# Altium project UV16 PDU.PrjPcb
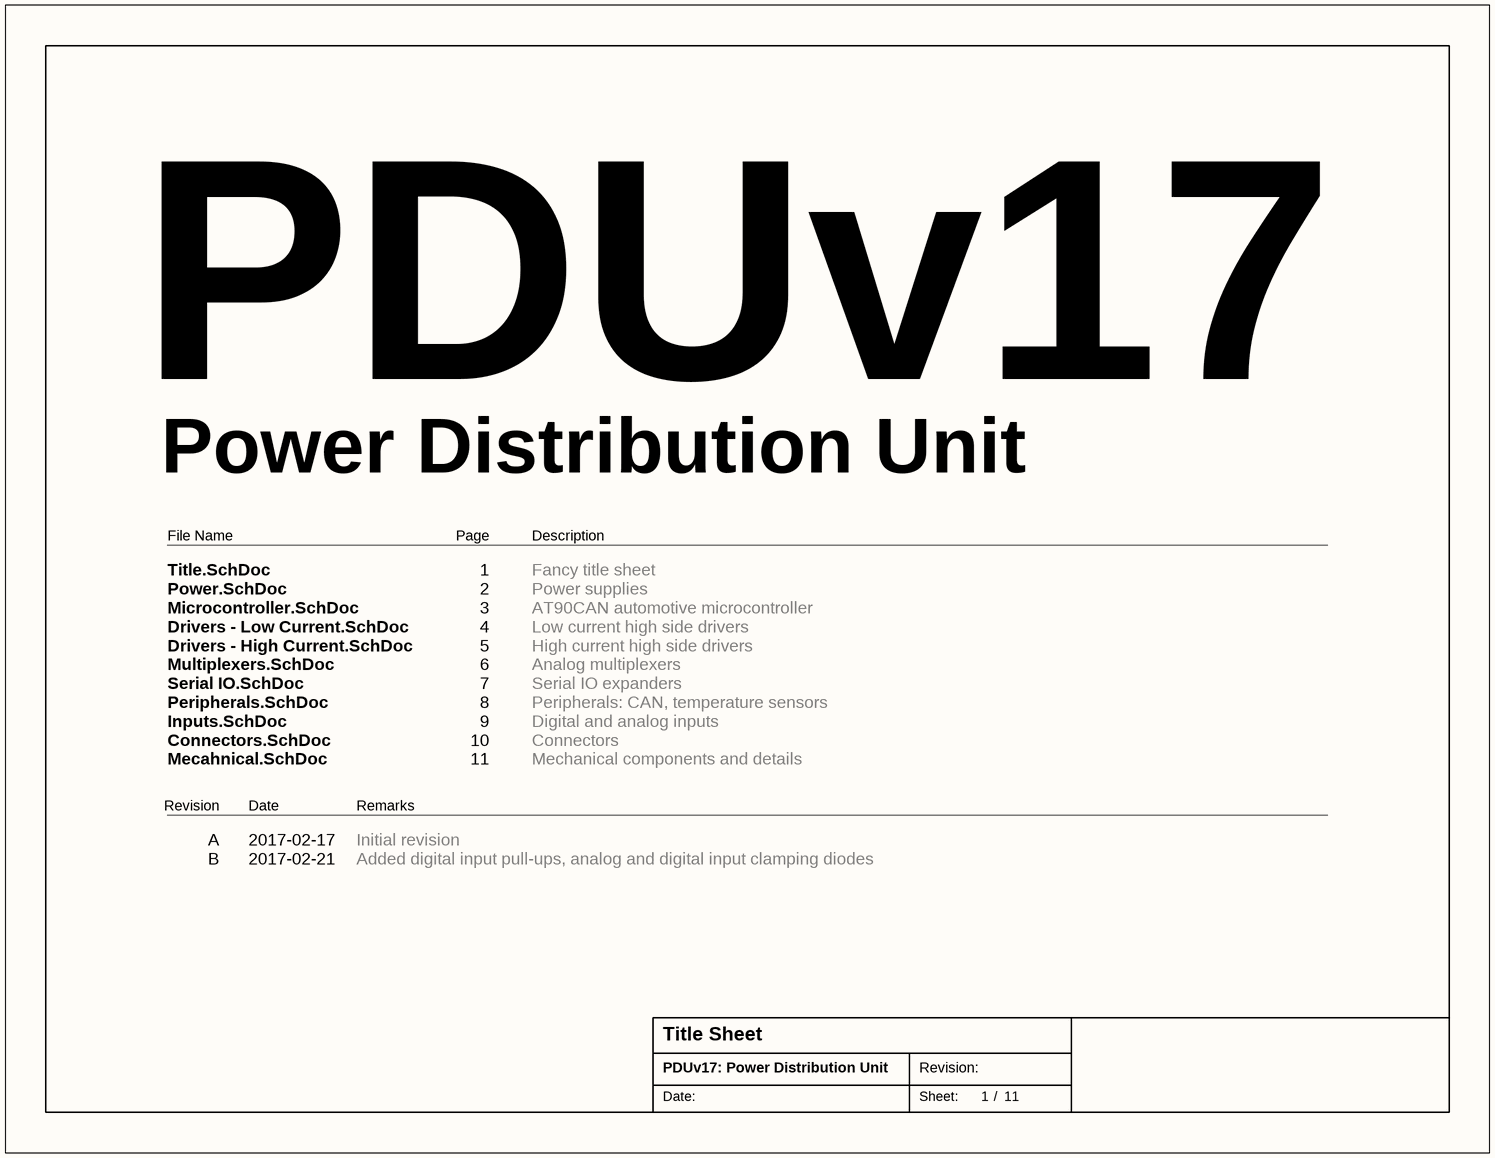
[diagram p0: Title.SchDoc]
4 sheets, 57 parts. Net scope: global (net labels, ports and power ports of the same name join across sheets).
Board file: UV16 PDU.PcbDoc
Sheets:
  Title.SchDoc
  Microcontroller.SchDoc
  Drivers.SchDoc
  Connectors.SchDoc

## Sheet Title.SchDoc: Title Sheet
size Letter; Date: 2017-02-17; Revision: A; SheetNumber: 1; SheetTotal: 11; ProjectTitle: PDUv17: Power Distribution Unit

### Notes on the sheet
- PDUv17
- Power Distribution Unit
- File Name
- Page
- Description
- Title.SchDoc
  Power.SchDoc
  Microcontroller.SchDoc
  Drivers - Low Current.SchDoc
  Drivers - High Current.SchDoc
  Multiplexers.SchDoc
  Serial IO.SchDoc
  Peripherals.SchDoc
  Inputs.SchDoc
  Connectors.SchDoc
  Mecahnical.SchDoc
- 1
  2
  3
  4
  5
  6
  7
  8
  9
  10
  11
- Fancy title sheet
  Power supplies
  AT90CAN automotive microcontroller
  Low current high side drivers
  High current high side drivers
  Analog multiplexers
  Serial IO expanders
  Peripherals: CAN, temperature sensors
  Digital and analog inputs
  Connectors
  Mechanical components and details
- Revision
- Date
- Remarks
- A
  B
- 2017-02-17
  2017-02-21
- Initial revision
  Added digital input pull-ups, analog and digital input clamping diodes
- Date:
- Revision:
- Sheet:
- /

## Sheet Microcontroller.SchDoc: Microcontroller
size Letter; Date: 2017-02-17; Revision: A; SheetNumber: 3; SheetTotal: 11; ProjectTitle: PDUv17: Power Distribution Unit
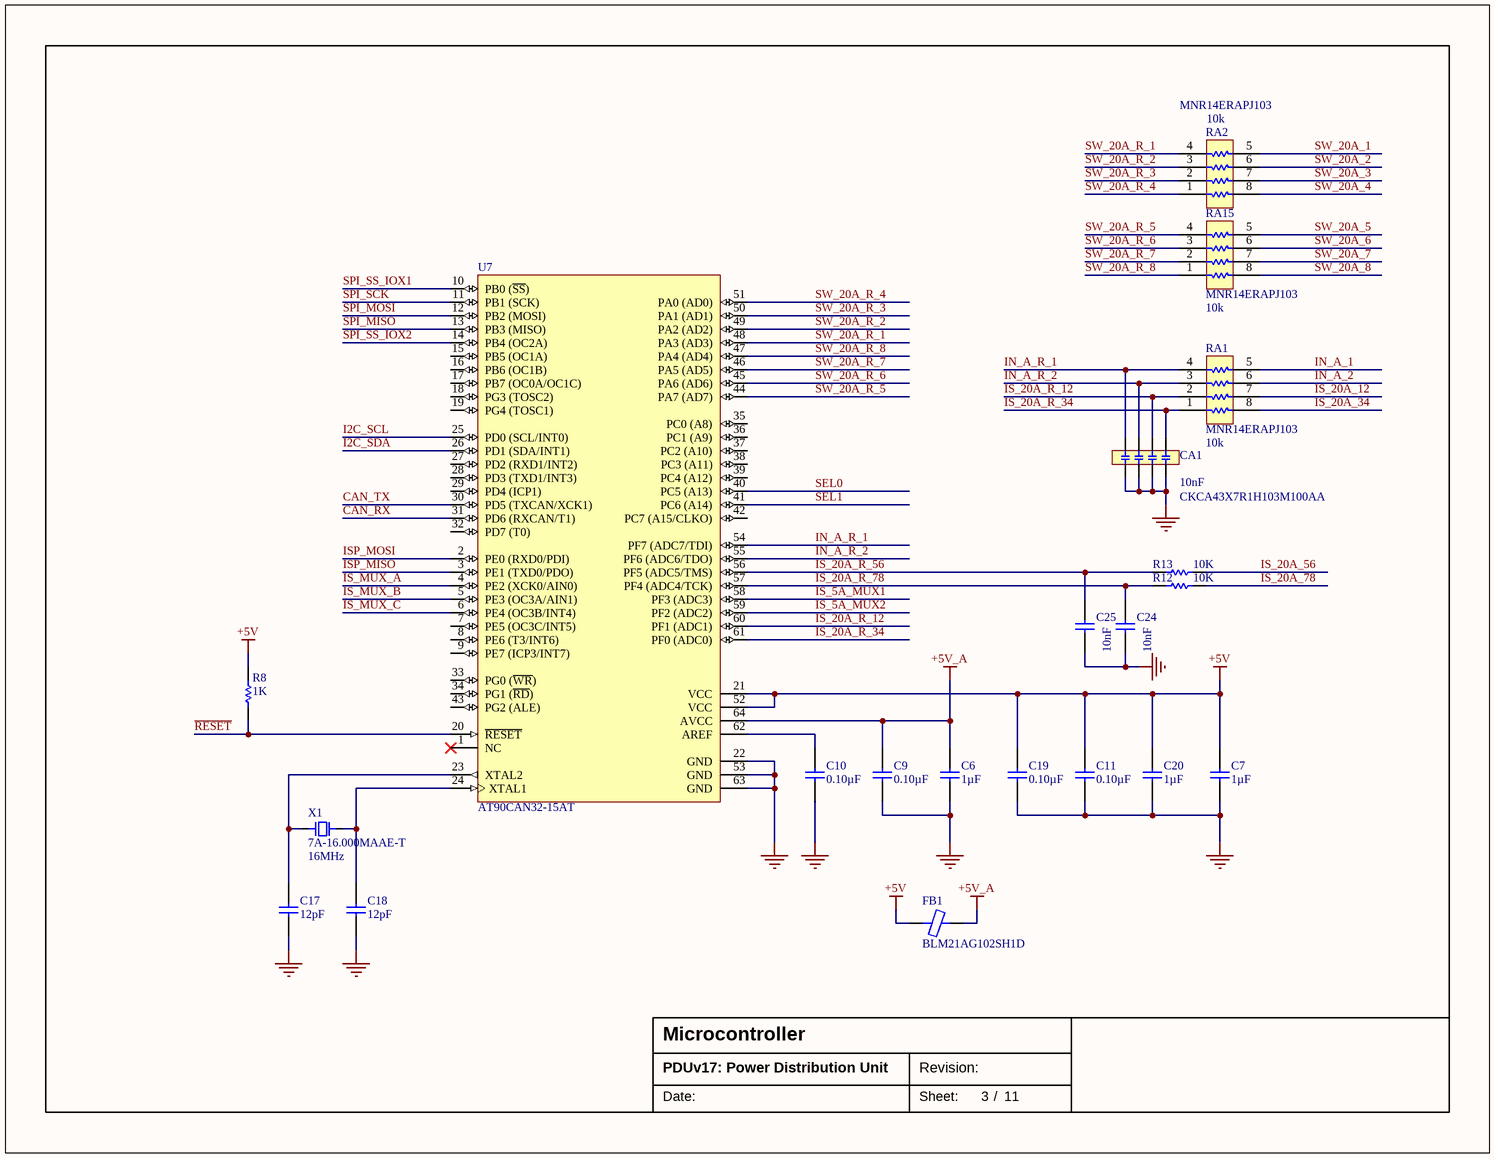
[diagram p1: Microcontroller.SchDoc]

### Parts
(Parts that share a designator on the sheet are numbered #1, #2 ... from top to bottom, then left to right.)
C6  value 1µF  [CAP-0805-M]  (hidden comment: CAP 1µF ±10% 16V 0805 X7R)
C7  value 1µF  [CAP-0805-M]  (hidden comment: CAP 1µF ±10% 16V 0805 X7R)
C9  value 0.10µF  [CAP-0402-M]  (hidden comment: CAP 0.10µF ±10% 16V 0402 X7R)
C10  value 0.10µF  [CAP-0402-M]  (hidden comment: CAP 0.10µF ±10% 16V 0402 X7R)
C11  value 0.10µF  [CAP-0402-M]  (hidden comment: CAP 0.10µF ±10% 16V 0402 X7R)
C17  value 12pF  [CAP-0402-M]  (hidden comment: CAP 12pF ±5% 50V 0402 C0G, NP0)
C18  value 12pF  [CAP-0402-M]  (hidden comment: CAP 12pF ±5% 50V 0402 C0G, NP0)
C19  value 0.10µF  [CAP-0402-M]  (hidden comment: CAP 0.10µF ±10% 16V 0402 X7R)
C20  value 1µF  [CAP-0805-M]  (hidden comment: CAP 1µF ±10% 16V 0805 X7R)
C24  value 10nF  [CAP-0402-M]  (hidden comment: CAP 10000pF ±10% 16V 0402 X7R)
C25  value 10nF  [CAP-0402-M]  (hidden comment: CAP 10000pF ±10% 16V 0402 X7R)
CA1  CKCA43X7R1H103M100AA  value 10nF  [CAF-80P319X159-8N]
FB1  BLM21AG102SH1D  [INDC2012X11N]
R8#1  value 1K  [RES-0603-M]  (hidden comment: RES 1K 1% 1/10 W 0603 ±100ppm/°C)
R12#1  value 10K  [RES-0603-M]  (hidden comment: RES 10K 1% 1/10 W 0603 ±100ppm/°C)
R13#1  value 10K  [RES-0603-M]  (hidden comment: RES 10K 1% 1/10 W 0603 ±100ppm/°C)
RA1  MNR14ERAPJ103  value 10k  [CAC-80P319X150-8N]
RA2  MNR14ERAPJ103  value 10k  [CAC-80P319X150-8N]
RA15  MNR14ERAPJ103  value 10k  [CAC-80P319X150-8N]
U7  AT90CAN32-15AT  [TQFP80P1600X1600X120-64N]
X1  7A-16.000MAAE-T  value 16MHz  [QFN200P500X320X135-2N]

### Nets
+5V: C7.1 C11.2 C19.2 C20.1 FB1.1 R8#1.1 U7.21(VCC) U7.52(VCC)
+5V_A: C6.1 C9.2 FB1.2 U7.64(AVCC)
GND: C6.2 C7.2 C9.1 C10.1 C11.1 C17.1 C18.1 C19.1 C20.2 C24.1 C25.1 CA1.1 CA1.2 CA1.3 CA1.4 U7.22(GND) U7.53(GND) U7.63(GND)
CAN_RX: U7.31(PD6_(RXCAN/T1))
CAN_TX: U7.30(PD5_(TXCAN/XCK1))
I2C_SCL: U7.25(PD0_(SCL/INT0))
I2C_SDA: U7.26(PD1_(SDA/INT1))
IN_A_1: RA1.5
IN_A_2: RA1.6
IN_A_R_1: CA1.5 RA1.4 U7.54(PF7_(ADC7/TDI))
IN_A_R_2: CA1.6 RA1.3 U7.55(PF6_(ADC6/TDO))
IS_5A_MUX1: U7.58(PF3_(ADC3))
IS_5A_MUX2: U7.59(PF2_(ADC2))
IS_20A_12: RA1.7
IS_20A_34: RA1.8
IS_20A_56: R13#1.1
IS_20A_78: R12#1.1
IS_20A_R_12: CA1.7 RA1.2 U7.60(PF1_(ADC1))
IS_20A_R_34: CA1.8 RA1.1 U7.61(PF0_(ADC0))
IS_20A_R_56: C25.2 R13#1.2 U7.56(PF5_(ADC5/TMS))
IS_20A_R_78: C24.2 R12#1.2 U7.57(PF4_(ADC4/TCK))
IS_MUX_A: U7.4(PE2_(XCK0/AIN0))
IS_MUX_B: U7.5(PE3_(OC3A/AIN1))
IS_MUX_C: U7.6(PE4_(OC3B/INT4))
ISP_MISO: U7.3(PE1_(TXD0/PDO))
ISP_MOSI: U7.2(PE0_(RXD0/PDI))
~{RESET}: R8#1.2 U7.20(~{RESET})
SEL0: U7.40(PC5_(A13))
SEL1: U7.41(PC6_(A14))
SPI_MISO: U7.13(PB3_(MISO))
SPI_MOSI: U7.12(PB2_(MOSI))
SPI_SCK: U7.11(PB1_(SCK))
SPI_SS_IOX1: U7.10(PB0_(~{SS}))
SPI_SS_IOX2: U7.14(PB4_(OC2A))
SW_20A_1: RA2.5
SW_20A_2: RA2.6
SW_20A_3: RA2.7
SW_20A_4: RA2.8
SW_20A_5: RA15.5
SW_20A_6: RA15.6
SW_20A_7: RA15.7
SW_20A_8: RA15.8
SW_20A_R_1: RA2.4 U7.48(PA3_(AD3))
SW_20A_R_2: RA2.3 U7.49(PA2_(AD2))
SW_20A_R_3: RA2.2 U7.50(PA1_(AD1))
SW_20A_R_4: RA2.1 U7.51(PA0_(AD0))
SW_20A_R_5: RA15.4 U7.44(PA7_(AD7))
SW_20A_R_6: RA15.3 U7.45(PA6_(AD6))
SW_20A_R_7: RA15.2 U7.46(PA5_(AD5))
SW_20A_R_8: RA15.1 U7.47(PA4_(AD4))
NetC10_2: C10.2 U7.62(AREF)
NetC17_2: C17.2 U7.23(XTAL2) X1.1
NetC18_2: C18.2 U7.24(XTAL1) X1.2

Not connected (* = marked no-connect by the designer): U7 1(NC)* 7(PE5_(OC3C/INT5)) 8(PE6_(T3/INT6)) 9(PE7_(ICP3/INT7)) 15(PB5_(OC1A)) 16(PB6_(OC1B)) 17(PB7_(OC0A/OC1C)) 18(PG3_(TOSC2)) 19(PG4_(TOSC1)) 27(PD2_(RXD1/INT2)) 28(PD3_(TXD1/INT3)) 29(PD4_(ICP1)) 32(PD7_(T0)) 33(PG0_(~{WR})) 34(PG1_(~{RD})) 35(PC0_(A8)) 36(PC1_(A9)) 37(PC2_(A10)) 38(PC3_(A11)) 39(PC4_(A12)) 42(PC7_(A15/CLKO)) 43(PG2_(ALE))

### Notes on the sheet
- Date:
- Revision:
- Sheet:
- /

### Library data of the parts
C6 C7 C20 = CC0805KKX7R7BB105: Manufacturer: Yageo; Manufacturer Series: CC; Part Number: CC0805KKX7R7BB105; Component Type: Standard; Tolerance: ±10%; Voltage: 16V; Package: 0805; Temperature Coefficient: X7R; Temperature Range: -55°C ~ 125°C; Supplier 1: Digi-Key; Supplier Part Number 1: 311-1365-1-ND
C9-C11 C19 = CC0402KRX7R7BB104: Manufacturer: Yageo; Manufacturer Series: CC; Part Number: CC0402KRX7R7BB104; Component Type: Standard; Tolerance: ±10%; Voltage: 16V; Package: 0402; Temperature Coefficient: X7R; Temperature Range: -55°C ~ 125°C; Supplier 1: Digi-Key; Supplier Part Number 1: 311-1338-1-ND
C17 C18 = CC0402JRNPO9BN120: Manufacturer: Yageo; Manufacturer Series: CC; Part Number: CC0402JRNPO9BN120; Component Type: Standard; Tolerance: ±5%; Voltage: 50V; Package: 0402; Temperature Coefficient: C0G, NP0; Temperature Range: -55°C ~ 125°C; Supplier 1: Digi-Key; Supplier Part Number 1: 311-1016-1-ND
C24 C25 = CC0402KRX7R7BB103: Manufacturer: Yageo; Manufacturer Series: CC; Part Number: CC0402KRX7R7BB103; Component Type: Standard; Tolerance: ±10%; Voltage: 16V; Package: 0402; Temperature Coefficient: X7R; Temperature Range: -55°C ~ 125°C; Supplier 1: Digi-Key; Supplier Part Number 1: 311-1042-1-ND
R8#1 = RC0603FR-071KL: Manufacturer: Yageo; Manufacturer Series: RC; Power: 1/10 W; Part Number: RC0603FR-071KL; Component Type: Standard; Tolerance: 1%; Package: 0603; Temperature Coefficient: ±100ppm/°C; Temperature Range: -55°C ~ 155°C; Supplier 1: Digi-Key; Supplier Part Number 1: 311-1.00KHRCT-ND
R12#1 R13#1 = RC0603FR-0710KL: Manufacturer: Yageo; Manufacturer Series: RC; Power: 1/10 W; Part Number: RC0603FR-0710KL; Component Type: Standard; Tolerance: 1%; Package: 0603; Temperature Coefficient: ±100ppm/°C; Temperature Range: -55°C ~ 155°C; Supplier 1: Digi-Key; Supplier Part Number 1: 311-10.0KHRCT-ND
X1 = 7A-16.000MAAE-T: SMD Crystal Oscillator 12 pF; Load Capacitance: 12pF; Supplier 1: Digi-Key; Supplier Part Number 1: 887-1747-1-ND
FB1 = BLM21AG102SH1D: Supplier 1: Digi-Key; Supplier Part Number 1: 490-10664-1-ND
U7 = AT90CAN32-15AT: Supplier 1: Digi-Key; Supplier Part Number 1: AT90CAN32-15ATCT-ND

## Sheet Drivers.SchDoc: Drivers
size Letter; Date: 2015-12-16; Revision: 5; SheetNumber: 3; SheetTotal: 4; ProjectTitle: Power Distribution Unit
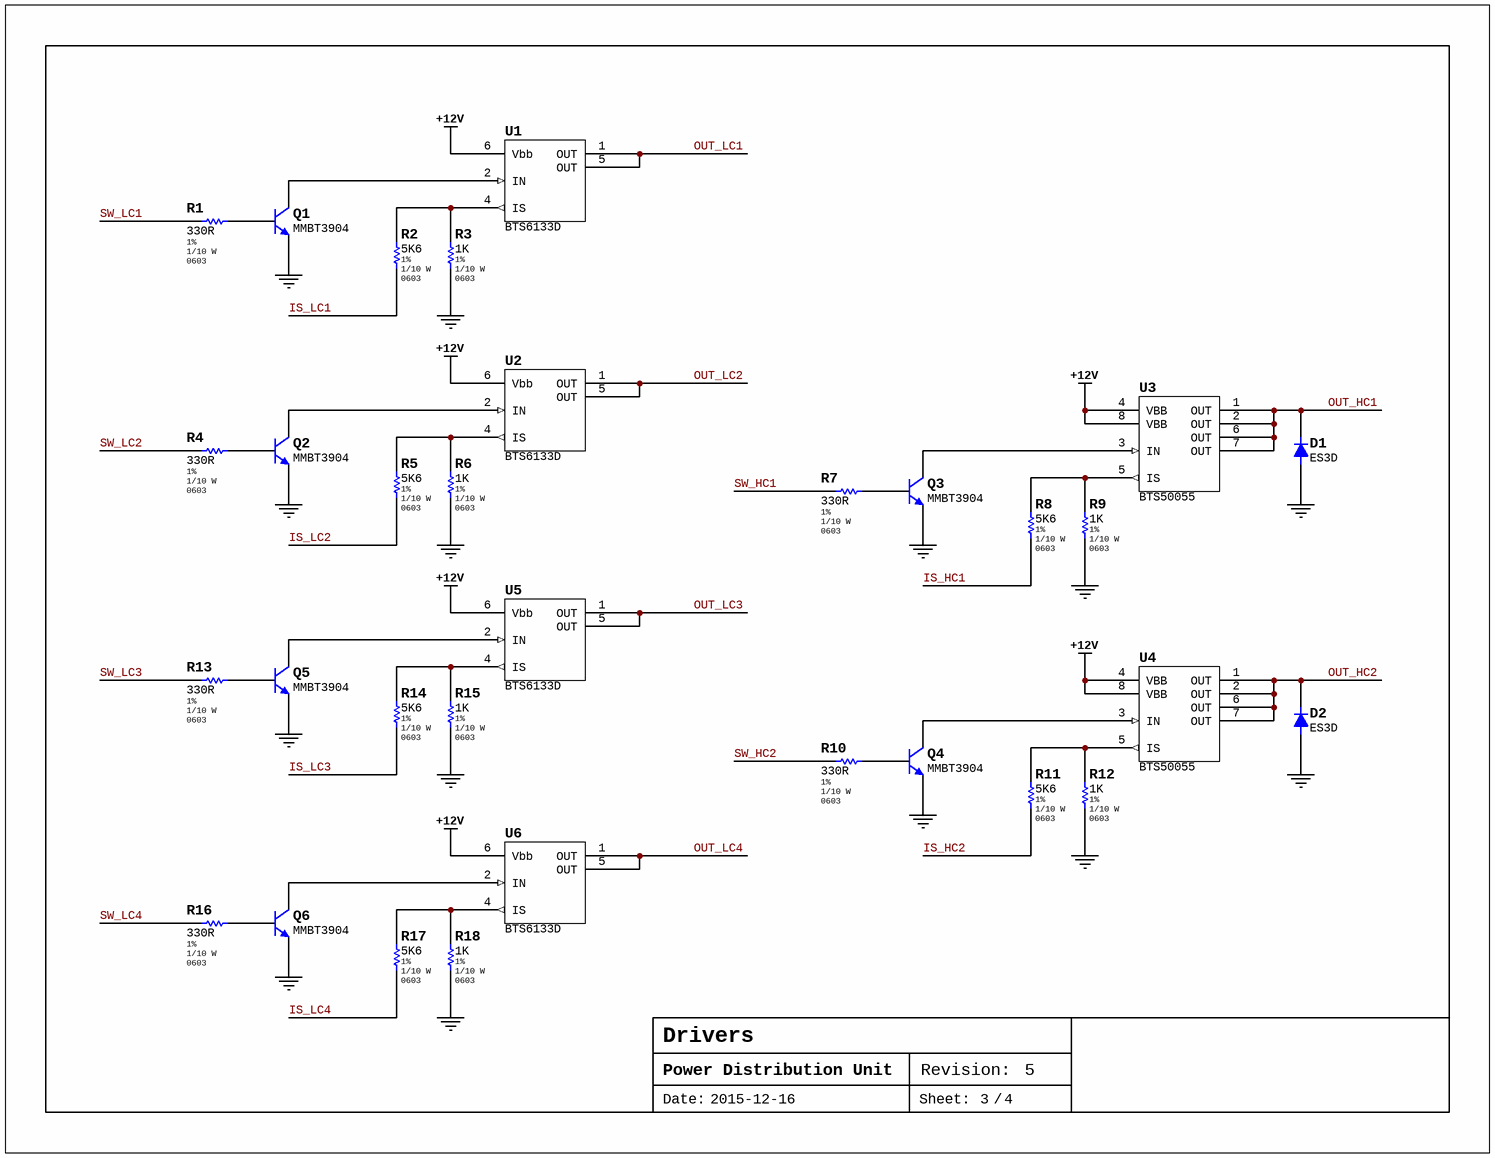
[diagram p2: Drivers.SchDoc]

### Parts
(Parts that share a designator on the sheet are numbered #1, #2 ... from top to bottom, then left to right.)
D1  ES3D  [DIOM6959X26M]
D2  ES3D  [DIOM6959X26M]
Q1  MMBT3904  [SOT23-3]
Q2  MMBT3904  [SOT23-3]
Q3  MMBT3904  [SOT23-3]
Q4  MMBT3904  [SOT23-3]
Q5  MMBT3904  [SOT23-3]
Q6  MMBT3904  [SOT23-3]
R1  330R  Tolerance: 1%  Power: 1/10 W  Package: 0603  [RES-0603-M]
R2  5K6  Tolerance: 1%  Power: 1/10 W  Package: 0603  [RES-0603-M]
R3  1K  Tolerance: 1%  Power: 1/10 W  Package: 0603  [RES-0603-M]
R4  330R  Tolerance: 1%  Power: 1/10 W  Package: 0603  [RES-0603-M]
R5  5K6  Tolerance: 1%  Power: 1/10 W  Package: 0603  [RES-0603-M]
R6  1K  Tolerance: 1%  Power: 1/10 W  Package: 0603  [RES-0603-M]
R7  330R  Tolerance: 1%  Power: 1/10 W  Package: 0603  [RES-0603-M]
R8#2  5K6  Tolerance: 1%  Power: 1/10 W  Package: 0603  [RES-0603-M]
R9  1K  Tolerance: 1%  Power: 1/10 W  Package: 0603  [RES-0603-M]
R10  330R  Tolerance: 1%  Power: 1/10 W  Package: 0603  [RES-0603-M]
R11  5K6  Tolerance: 1%  Power: 1/10 W  Package: 0603  [RES-0603-M]
R12#2  1K  Tolerance: 1%  Power: 1/10 W  Package: 0603  [RES-0603-M]
R13#2  330R  Tolerance: 1%  Power: 1/10 W  Package: 0603  [RES-0603-M]
R14  5K6  Tolerance: 1%  Power: 1/10 W  Package: 0603  [RES-0603-M]
R15  1K  Tolerance: 1%  Power: 1/10 W  Package: 0603  [RES-0603-M]
R16  330R  Tolerance: 1%  Power: 1/10 W  Package: 0603  [RES-0603-M]
R17  5K6  Tolerance: 1%  Power: 1/10 W  Package: 0603  [RES-0603-M]
R18  1K  Tolerance: 1%  Power: 1/10 W  Package: 0603  [RES-0603-M]
U1  BTS6133D  [PG-TO220-5-11]
U2  BTS6133D  [PG-TO220-5-11]
U3  BTS50055  [P/PG-TO220-7-4]
U4  BTS50055  [P/PG-TO220-7-4]
U5  BTS6133D  [PG-TO220-5-11]
U6  BTS6133D  [PG-TO220-5-11]

### Nets
+12V: U1.6(Vbb) U2.6(Vbb) U3.4(VBB) U3.8(VBB) U4.4(VBB) U4.8(VBB) U5.6(Vbb) U6.6(Vbb)
GND: D1.2(A) D2.2(A) Q1.2(E) Q2.2(E) Q3.2(E) Q4.2(E) Q5.2(E) Q6.2(E) R3.1 R6.1 R9.1 R12#2.1 R15.1 R18.1
IS_HC1: R8#2.1
IS_HC2: R11.1
IS_LC1: R2.1
IS_LC2: R5.1
IS_LC3: R14.1
IS_LC4: R17.1
OUT_HC1: D1.1(K) U3.1(OUT) U3.2(OUT) U3.6(OUT) U3.7(OUT)
OUT_HC2: D2.1(K) U4.1(OUT) U4.2(OUT) U4.6(OUT) U4.7(OUT)
OUT_LC1: U1.1(OUT) U1.5(OUT)
OUT_LC2: U2.1(OUT) U2.5(OUT)
OUT_LC3: U5.1(OUT) U5.5(OUT)
OUT_LC4: U6.1(OUT) U6.5(OUT)
SW_HC1: R7.1
SW_HC2: R10.1
SW_LC1: R1.1
SW_LC2: R4.1
SW_LC3: R13#2.1
SW_LC4: R16.1
NetQ1_1: Q1.1(B) R1.2
NetQ1_3: Q1.3(C) U1.2(IN)
NetQ2_1: Q2.1(B) R4.2
NetQ2_3: Q2.3(C) U2.2(IN)
NetQ3_1: Q3.1(B) R7.2
NetQ3_3: Q3.3(C) U3.3(IN)
NetQ4_1: Q4.1(B) R10.2
NetQ4_3: Q4.3(C) U4.3(IN)
NetQ5_1: Q5.1(B) R13#2.2
NetQ5_3: Q5.3(C) U5.2(IN)
NetQ6_1: Q6.1(B) R16.2
NetQ6_3: Q6.3(C) U6.2(IN)
NetR2_2: R2.2 R3.2 U1.4(IS)
NetR5_2: R5.2 R6.2 U2.4(IS)
NetR8#2_2: R8#2.2 R9.2 U3.5(IS)
NetR11_2: R11.2 R12#2.2 U4.5(IS)
NetR14_2: R14.2 R15.2 U5.4(IS)
NetR17_2: R17.2 R18.2 U6.4(IS)

### Notes on the sheet
- Date:
- Sheet:
- Revision:
- /

### Library data of the parts
R1 R4 R7 R10 R13#2 R16 = RC0603FR-07330RL: Manufacturer: Yageo; Manufacturer Series: RC; Temperature Coefficient: ±100ppm/°C; Part Number: RC0603FR-07330RL; Component Type: Standard; Value: 330R; Temperature Range: -55°C ~ 155°C; Supplier 1: Digi-Key; Supplier Part Number 1: 311-330HRCT-ND
R2 R5 R8#2 R11 R14 R17 = RC0603FR-075K6L: Manufacturer: Yageo; Manufacturer Series: RC; Temperature Coefficient: ±100ppm/°C; Part Number: RC0603FR-075K6L; Component Type: Standard; Value: 5K6; Temperature Range: -55°C ~ 155°C; Supplier 1: Digi-Key; Supplier Part Number 1: 311-5.60KHRCT-ND
R3 R6 R9 R12#2 R15 R18 = RC0603FR-071KL: Manufacturer: Yageo; Manufacturer Series: RC; Temperature Coefficient: ±100ppm/°C; Part Number: RC0603FR-071KL; Component Type: Standard; Value: 1K; Temperature Range: -55°C ~ 155°C; Supplier 1: Digi-Key; Supplier Part Number 1: 311-1.00KHRCT-ND
D1 D2 = ES3D: Supplier 1: Mouser; Supplier Part Number 1: 512-ES3D
Q1-Q6 = MMBT3904: Supplier 1: Digi-Key; Supplier Part Number 1: MMBT3904LT1GOSCT-ND
U1 U2 U5 U6 = BTS6133D: Supplier 1: Digi-Key; Supplier Part Number 1: BTS6133DCT-ND
U3 U4 = BTS50055: Supplier 1: Digi-Key; Supplier Part Number 1: BTS50055-1TMACT-ND

## Sheet Connectors.SchDoc: Connectors
size Letter; Date: 2017-02-17; Revision: A; SheetNumber: 10; SheetTotal: 11; ProjectTitle: PDUv17: Power Distribution Unit
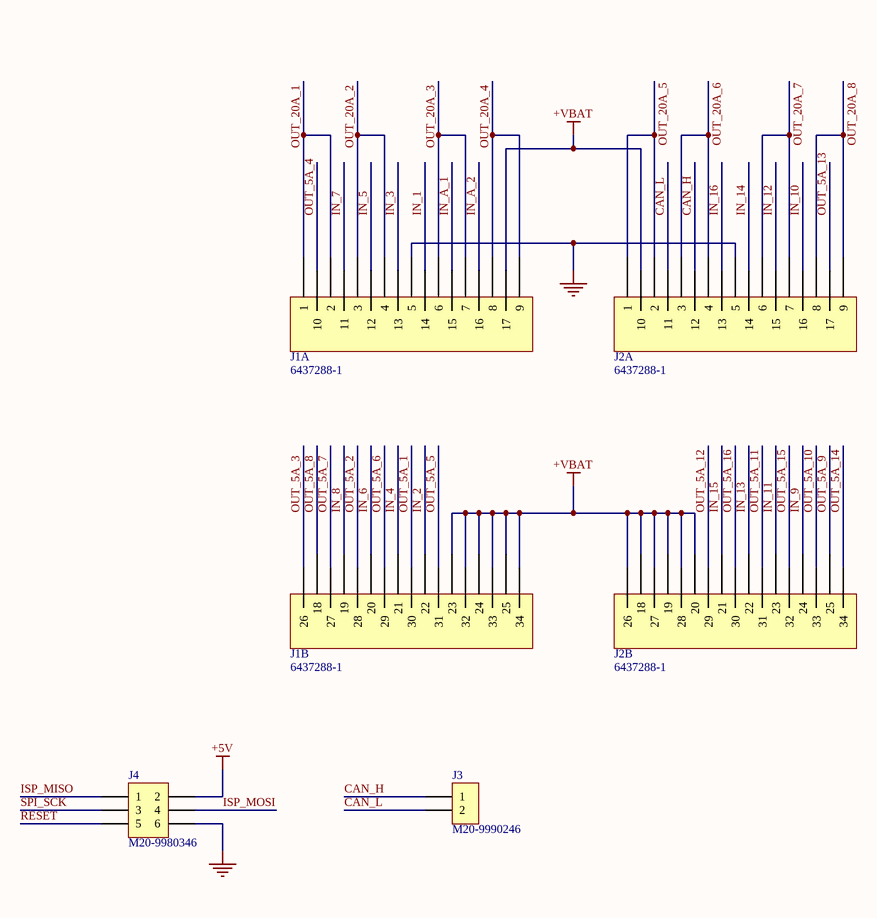
[diagram p3: Connectors.SchDoc]

### Parts
J1  6437288-1  [6437288-1]  (parts A,B of 2)
J2  6437288-1  [6437288-1]  (parts A,B of 2)
J3  M20-9990246  [M20-9990246]
J4  M20-9980346  [M20-9980346]

### Nets
+5V: J4.2
+VBAT: J1.17 J1.23 J1.24 J1.25 J1.32 J1.33 J1.34 J2.10 J2.18 J2.19 J2.20 J2.26 J2.27 J2.28
GND: J1.5 J2.5 J4.6
CAN_H: J2.12 J3.1
CAN_L: J2.11 J3.2
IN_1: J1.14
IN_2: J1.22
IN_3: J1.13
IN_4: J1.21
IN_5: J1.12
IN_6: J1.20
IN_7: J1.11
IN_8: J1.19
IN_9: J2.24
IN_10: J2.16
IN_11: J2.23
IN_12: J2.15
IN_13: J2.22
IN_14: J2.14
IN_15: J2.21
IN_16: J2.13
IN_A_1: J1.15
IN_A_2: J1.16
ISP_MISO: J4.1
ISP_MOSI: J4.4
OUT_5A_1: J1.30
OUT_5A_2: J1.28
OUT_5A_3: J1.26
OUT_5A_4: J1.10
OUT_5A_5: J1.31
OUT_5A_6: J1.29
OUT_5A_7: J1.27
OUT_5A_8: J1.18
OUT_5A_9: J2.25
OUT_5A_10: J2.33
OUT_5A_11: J2.31
OUT_5A_12: J2.29
OUT_5A_13: J2.17
OUT_5A_14: J2.34
OUT_5A_15: J2.32
OUT_5A_16: J2.30
OUT_20A_1: J1.1 J1.2
OUT_20A_2: J1.3 J1.4
OUT_20A_3: J1.6 J1.7
OUT_20A_4: J1.8 J1.9
OUT_20A_5: J2.1 J2.2
OUT_20A_6: J2.3 J2.4
OUT_20A_7: J2.6 J2.7
OUT_20A_8: J2.8 J2.9
~{RESET}: J4.5
SPI_SCK: J4.3

### Notes on the sheet
- Date:
- Revision:
- Sheet:
- /

### Library data of the parts
J1 J2 = 6437288-1: Superseal 34-way right angle PCB header
J3 = M20-9990246: 2.54mm Header 1x2-Pin; Supplier 1: Digi-Key; Supplier Part Number 1: 952-2262-ND
J4 = M20-9980346: 2.54mm Header 2x3-Pin; Supplier 1: Digi-Key; Supplier Part Number 1: 952-2121-ND

## Nets that join several sheets
+5V: Microcontroller (8 pins), Connectors (J4.2)
GND: Microcontroller (18 pins), Drivers (14 pins), Connectors (J1.5 J2.5 J4.6)
IN_A_1: Microcontroller (RA1.5), Connectors (J1.15)
IN_A_2: Microcontroller (RA1.6), Connectors (J1.16)
ISP_MISO: Microcontroller (U7.3), Connectors (J4.1)
ISP_MOSI: Microcontroller (U7.2), Connectors (J4.4)
~{RESET}: Microcontroller (R8#1.2 U7.20), Connectors (J4.5)
SPI_SCK: Microcontroller (U7.11), Connectors (J4.3)